# EAGLE schematic 311_lora_es920_faboblocks (EAGLE 9.6.2)
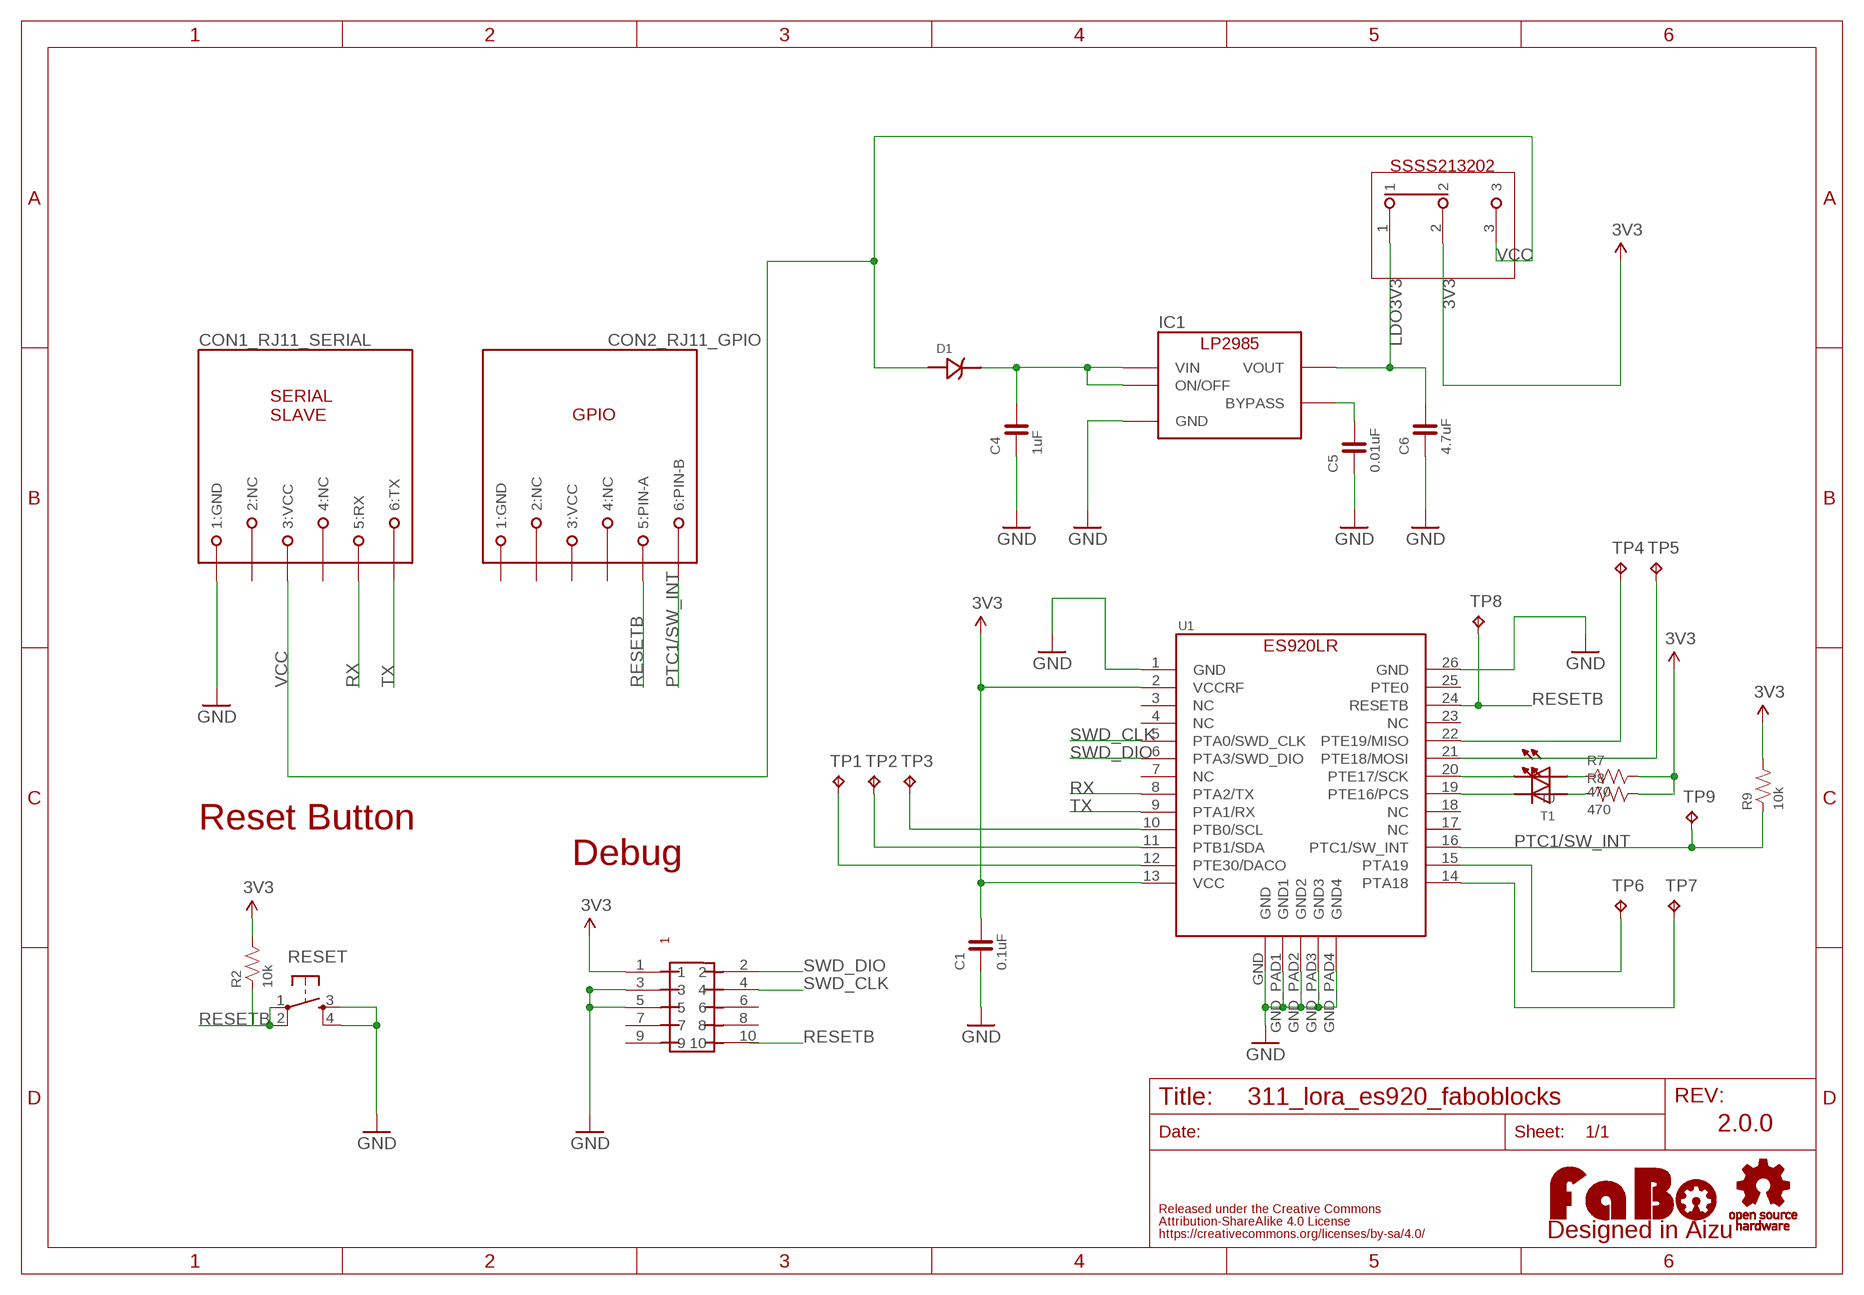
[diagram p0: schematic, sheet 1]

## Parts
C1  0.1uF  CAPACITOR-0603_NARROW  [0603-NARROW]
C4  1uF  CAPACITOR-0603_NARROW  [0603-NARROW]
C5  0.01uF  CAPACITOR-0603_NARROW  [0603-NARROW]
C6  4.7uF  CAPACITOR-0603_NARROW  [0603-NARROW]
CON1_RJ11_SERIAL  MODULAR-JACK-6P-RJ11_SERIAL_S  [7002-6PXC-X]
CON2_RJ11_GPIO  MODULAR-JACK-6P-RJ11_GPIO  [7002-6PXC-X]
D1  CUS05F40  [CUS05F40]
IC1  LP2985-33DBV  [SOT-23-5]
LOGO1  LOGO_FABO-M_BOTTOM  [LOGO_FABO_M_BOTTOM]
R2  10k  RESISTOR-0603-NARROW  [0603-NARROW]
R7  470  RESISTOR-0603-NARROW  [0603-NARROW]
R8  470  RESISTOR-0603-NARROW  [0603-NARROW]
R9  10k  RESISTOR-0603-NARROW  [0603-NARROW]
RESET  TACT-SWITCH-SMD_KMR2  [KMR2]
T0  LED-0603  [0603]
T1  LED-0603  [0603]
TP1  TPTP20R  [TP20R]
TP2  TPB1,27  [B1,27]
TP3  TPTP20R  [TP20R]
TP4  TPTP20R  [TP20R]
TP5  TPTP20R  [TP20R]
TP6  TPTP20R  [TP20R]
TP7  TPTP20R  [TP20R]
TP8  TPTP20R  [TP20R]
TP9  TPTP20R  [TP20R]
U1  ES920LR  [ES920LR]
U$3  LOGO_OSHW-M_BOTTOM  [LOGO_OSHW_M_BOTTOM]
U$5  SSSS213202  [SSSS213202]
U$8  PIN-HEADER-SMT(1.27MM)2X5  [PIN-HEADER-SMT(1.27MM)2X5]

## Nets
3V3: C1.2 R2.2 R7.2 R8.2 R9.2 U1.2(VCCRF) U1.13(VCC) U$5.2 U$8.1
GND: C1.1 C4.1 C5.1 C6.1 CON1_RJ11_SERIAL.1(1:GND) IC1.2(GND) RESET.3 RESET.4 U1.1(GND) U1.26(GND) U1.GND U1.GND_PAD1(GND1) U1.GND_PAD2(GND2) U1.GND_PAD3(GND3) U1.GND_PAD4(GND4) U$8.3 U$8.5
LDO3V3: C6.2 IC1.5(VOUT) U$5.1
N$3: T1.CATHODE U1.19(PTE16/PCS)
N$4: T0.CATHODE U1.20(PTE17/SCK)
N$5: R7.1 T0.ANODE
N$6: R8.1 T1.ANODE
N$9: C5.2 IC1.4(BYPASS)
N$10: TP6.TP U1.15(PTA19)
N$11: TP3.TP U1.10(PTB0/SCL)
N$12: TP2.TP U1.11(PTB1/SDA)
N$13: TP1.TP U1.12(PTE30/DACO)
N$14: TP4.TP U1.22(PTE19/MISO)
N$15: TP5.TP U1.21(PTE18/MOSI)
N$16: TP7.TP U1.14(PTA18)
N$17: C4.2 D1.C(CATHODE) IC1.1(VIN) IC1.3(ON/OFF)
PTC1/SW_INT: CON2_RJ11_GPIO.6(6:PIN-B) R9.1 TP9.TP U1.16(PTC1/SW_INT)
RESETB: CON2_RJ11_GPIO.5(5:PIN-A) R2.1 RESET.1 RESET.2 TP8.TP U1.24(RESETB) U$8.10
RX: CON1_RJ11_SERIAL.5(5:RX) U1.8(PTA2/TX)
SWD_CLK: U1.5(PTA0/SWD_CLK) U$8.4
SWD_DIO: U1.6(PTA3/SWD_DIO) U$8.2
TX: CON1_RJ11_SERIAL.6(6:TX) U1.9(PTA1/RX)
VCC: CON1_RJ11_SERIAL.3(3:VCC) D1.A(ANODE) U$5.3
Unconnected: CON1_RJ11_SERIAL.2(2:NC) CON1_RJ11_SERIAL.4(4:NC) CON2_RJ11_GPIO.2(2:NC) CON2_RJ11_GPIO.4(4:NC) U1.3(NC) U1.4(NC) U1.7(NC) U1.17(NC) U1.18(NC) U1.23(NC) U1.25(PTE0) U$8.6 U$8.7 U$8.8 U$8.9

## Notes on the sheet
- SSSS213202
- Reset Button
- Debug
- 2.0.0

## Power pins joined to a net without a drawn wire
1:GND: CON2_RJ11_GPIO.1(1:GND)
3:VCC: CON2_RJ11_GPIO.3(3:VCC)

## Library data of the parts
C1 C4-C6 = FaBo-Capacitor:CAPACITOR: CAPACITOR
CON1_RJ11_SERIAL = FaBo-Connetor:MODULAR-JACK-6P-RJ11_SERIAL_S
CON2_RJ11_GPIO = FaBo-Connetor:MODULAR-JACK-6P-RJ11_GPIO
D1 = FaBo-Diode:CUS05F40
IC1 = FaBo-Supply:LP2985: LP2985
LOGO1 = component:LOGO_FABO
R2 R7-R9 = FaBo-Resistors:RESISTOR: RESISTOR
RESET = FaBo-Switch:TACT-SWITCH
T0 T1 = FaBo-LED:LED
TP1-TP9 = testpad:TP: Test pad
U1 = FaBo-LoRa:ES920LR
U$3 = component:LOGO_OSHW
U$5 = FaBo-Switch:SSSS213202
U$8 = GClue:PIN-HEADER-SMT(1.27MM)2X5: PIN-HEADER-SMT (1.27MM) 2x5